# Altium schematic sheet STM32.SchDoc: STM32
size A4; Author: SchumyHao; DocumentNumber: 5; Revision: V01; SheetNumber: 5; SheetTotal: 7
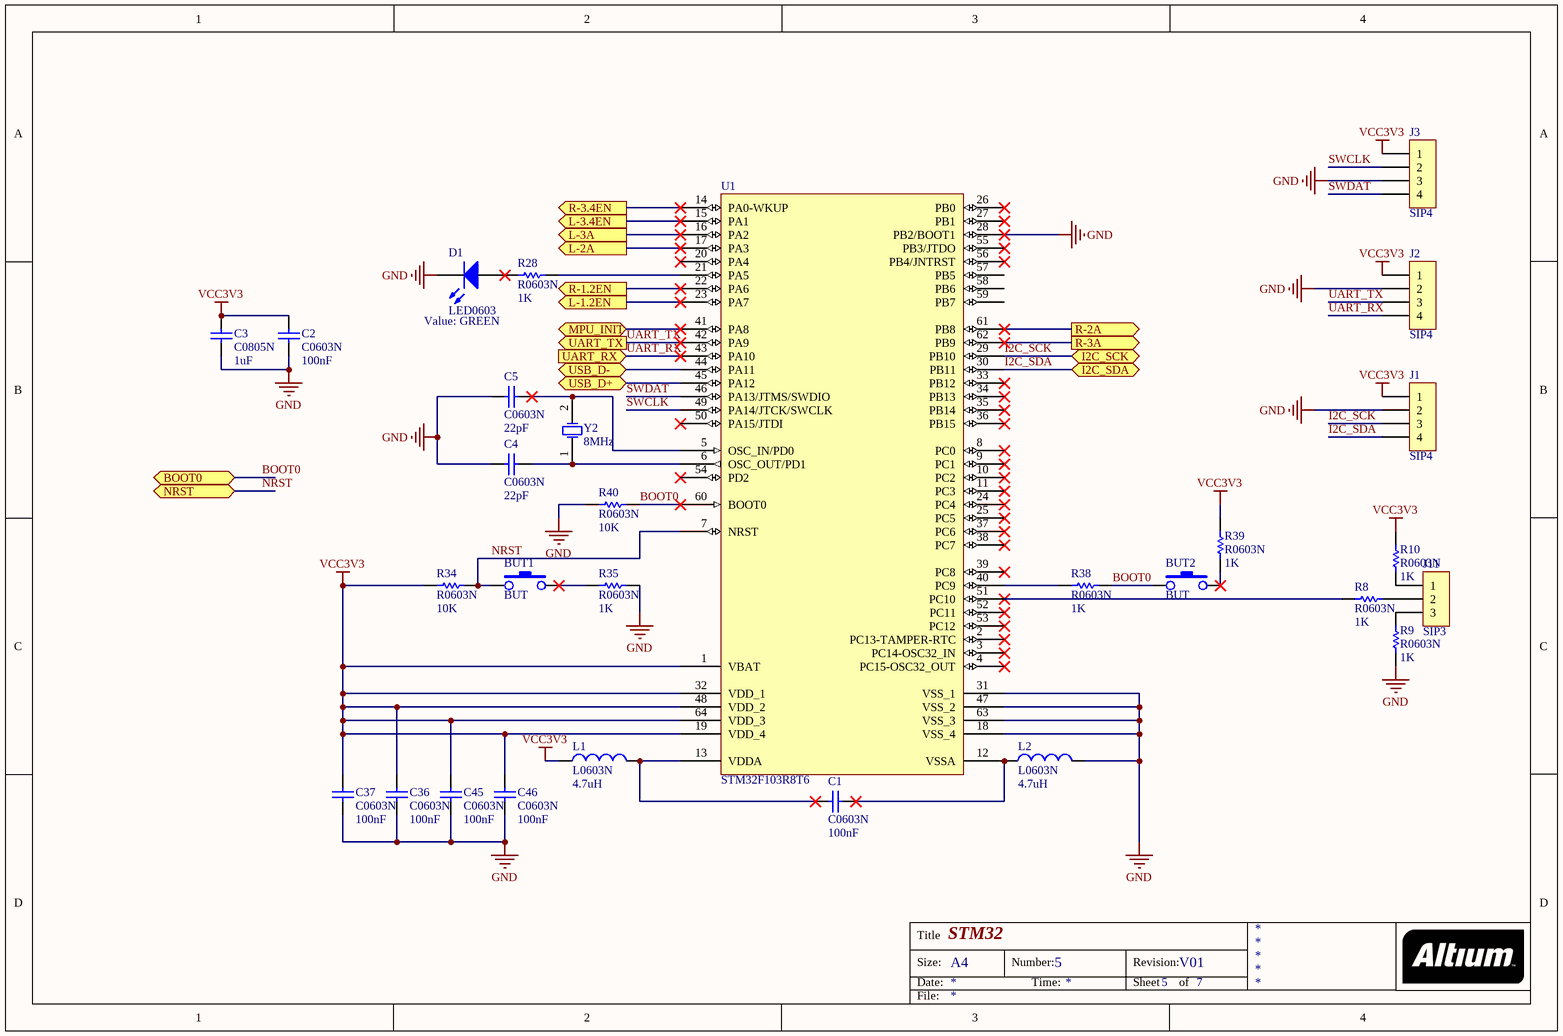
[diagram p0: STM32.SchDoc]

## Parts
BUT1  BUT  [AN66]
BUT2  BUT  [AN66]
C1  C0603N  value 100nF  [C0603N]
C2  C0603N  value 100nF  [C0603N]
C3  C0805N  value 1uF  [C0805N]
C4  C0603N  value 22pF  [C0603N]
C5  C0603N  value 22pF  [C0603N]
C36  C0603N  value 100nF  [C0603N]
C37  C0603N  value 100nF  [C0603N]
C45  C0603N  value 100nF  [C0603N]
C46  C0603N  value 100nF  [C0603N]
D1  LED0603  value GREEN  [LED0603]
J1  SIP4  [SIP4-2.54]
J2  SIP4  [SIP4-2.54]
J3  SIP4  [SIP4-2.54]
J11  SIP3  [SIP3]
L1  L0603N  value 4.7uH  [R0603N]
L2  L0603N  value 4.7uH  [R0603N]
R8  R0603N  value 1K  [R0603N]
R9  R0603N  value 1K  [R0603N]
R10  R0603N  value 1K  [R0603N]
R28  R0603N  value 1K  [R0603N]
R34  R0603N  value 10K  [R0603N]
R35  R0603N  value 1K  [R0603N]
R38  R0603N  value 1K  [R0603N]
R39  R0603N  value 1K  [R0603N]
R40  R0603N  value 10K  [R0603N]
U1  STM32F103R8T6  [LQFP64_N]
Y2  8MHz  [XTAL_5032_2]

## Ports
BOOT0, I2C_SCK (bidir), I2C_SDA (bidir), L-1.2EN (out), L-2A (out), L-3.4EN (out), L-3A (out), MPU_INIT (bidir), NRST, R-1.2EN (out), R-2A (out), R-3.4EN (out), R-3A (out), UART_RX (in), UART_TX (out), USB_D+ (bidir), USB_D- (bidir)

## Nets
GND: C2.1 C3.1 C4.2 C5.2 C36.1 C37.1 C45.1 C46.1 D1.2(K) J1.2 J2.2 J3.3 L2.2 R9.1 R35.2 R40.1 U1.18(VSS_4) U1.28(PB2/BOOT1) U1.31(VSS_1) U1.47(VSS_2) U1.63(VSS_3)
VCC3V3: C2.2 C3.2 C36.2 C37.2 C45.2 C46.2 J1.1 J2.1 J3.1 L1.1 R10.1 R34.1 R39.2 U1.1(VBAT) U1.19(VDD_4) U1.32(VDD_1) U1.48(VDD_2) U1.64(VDD_3)
BOOT0: BUT2.1 R38.2 R40.2 U1.60(BOOT0) ; port BOOT0
I2C_SCK: J1.3 U1.29(PB10) ; port I2C_SCK
I2C_SDA: J1.4 U1.30(PB11) ; port I2C_SDA
L-1.2EN: U1.23(PA7) ; port L-1.2EN
L-2A: U1.17(PA3) ; port L-2A
L-3.4EN: U1.15(PA1) ; port L-3.4EN
L-3A: U1.16(PA2) ; port L-3A
MPU_INIT: U1.41(PA8) ; port MPU_INIT
NRST: BUT1.1 R34.2 U1.7(NRST) ; port NRST
R-1.2EN: U1.22(PA6) ; port R-1.2EN
R-2A: U1.61(PB8) ; port R-2A
R-3.4EN: U1.14(PA0-WKUP) ; port R-3.4EN
R-3A: U1.62(PB9) ; port R-3A
SWCLK: J3.2 U1.49(PA14/JTCK/SWCLK)
SWDAT: J3.4 U1.46(PA13/JTMS/SWDIO)
UART_RX: J2.4 U1.43(PA10) ; port UART_RX
UART_TX: J2.3 U1.42(PA9) ; port UART_TX
USB_D+: U1.45(PA12) ; port USB_D+
USB_D-: U1.44(PA11) ; port USB_D-
NetBUT1_2: BUT1.2 R35.1
NetBUT2_2: BUT2.2 R39.1
NetC1_1: C1.1 L2.1 U1.12(VSSA)
NetC1_2: C1.2 L1.2 U1.13(VDDA)
NetC4_1: C4.1 U1.6(OSC_OUT/PD1) Y2.1(OSC1)
NetC5_1: C5.1 U1.5(OSC_IN/PD0) Y2.2(OSC2)
NetD1_1: D1.1(A) R28.1
NetJ11_1: J11.1 R10.2
NetJ11_2: J11.2 R8.2
NetJ11_3: J11.3 R9.2
NetR8_1: R8.1 U1.51(PC10)
NetR28_2: R28.2 U1.21(PA5)
NetR38_1: R38.1 U1.40(PC9)

Not connected (* = marked no-connect by the designer): U1 2(PC13-TAMPER-RTC)* 3(PC14-OSC32_IN)* 4(PC15-OSC32_OUT)* 8(PC0)* 9(PC1)* 10(PC2)* 11(PC3)* 20(PA4)* 24(PC4)* 25(PC5)* 26(PB0)* 27(PB1)* 33(PB12)* 34(PB13)* 35(PB14)* 36(PB15)* 37(PC6)* 38(PC7)* 39(PC8)* 50(PA15/JTDI)* 52(PC11)* 53(PC12)* 54(PD2)* 55(PB3/JTDO)* 56(PB4/JNTRST)* 57(PB5) 58(PB6) 59(PB7)

## Notes on the sheet
- Title
- Size:
- Date:
- A4
- Number:
- Time:
- Revision:
- Sheet
- of
- File:

## Library data of the parts
C1-C5 C36 C37 C45 C46 = Cap Semi: Capacitor (Semiconductor SIM Model)
D1 = LED
J1-J3 = SIP4: jointbar
L1 L2 = Inductor: Code_IEC: 1005; LatestRevisionDate: 29-May-2009; LatestRevisionNote: IPC-7351 Footprint Added.; PackageReference: 0402-A; Publisher: Altium Limited; PackageDescription: Chip Inductor; Code_JEITA: 0402
R8-R10 R28 R34 R35 R38-R40 = Res Semi: Semiconductor Resistor
Y2 = XTAL: Crystal Oscillator